# Altium schematic sheet P8_ref.SchDoc
size A3
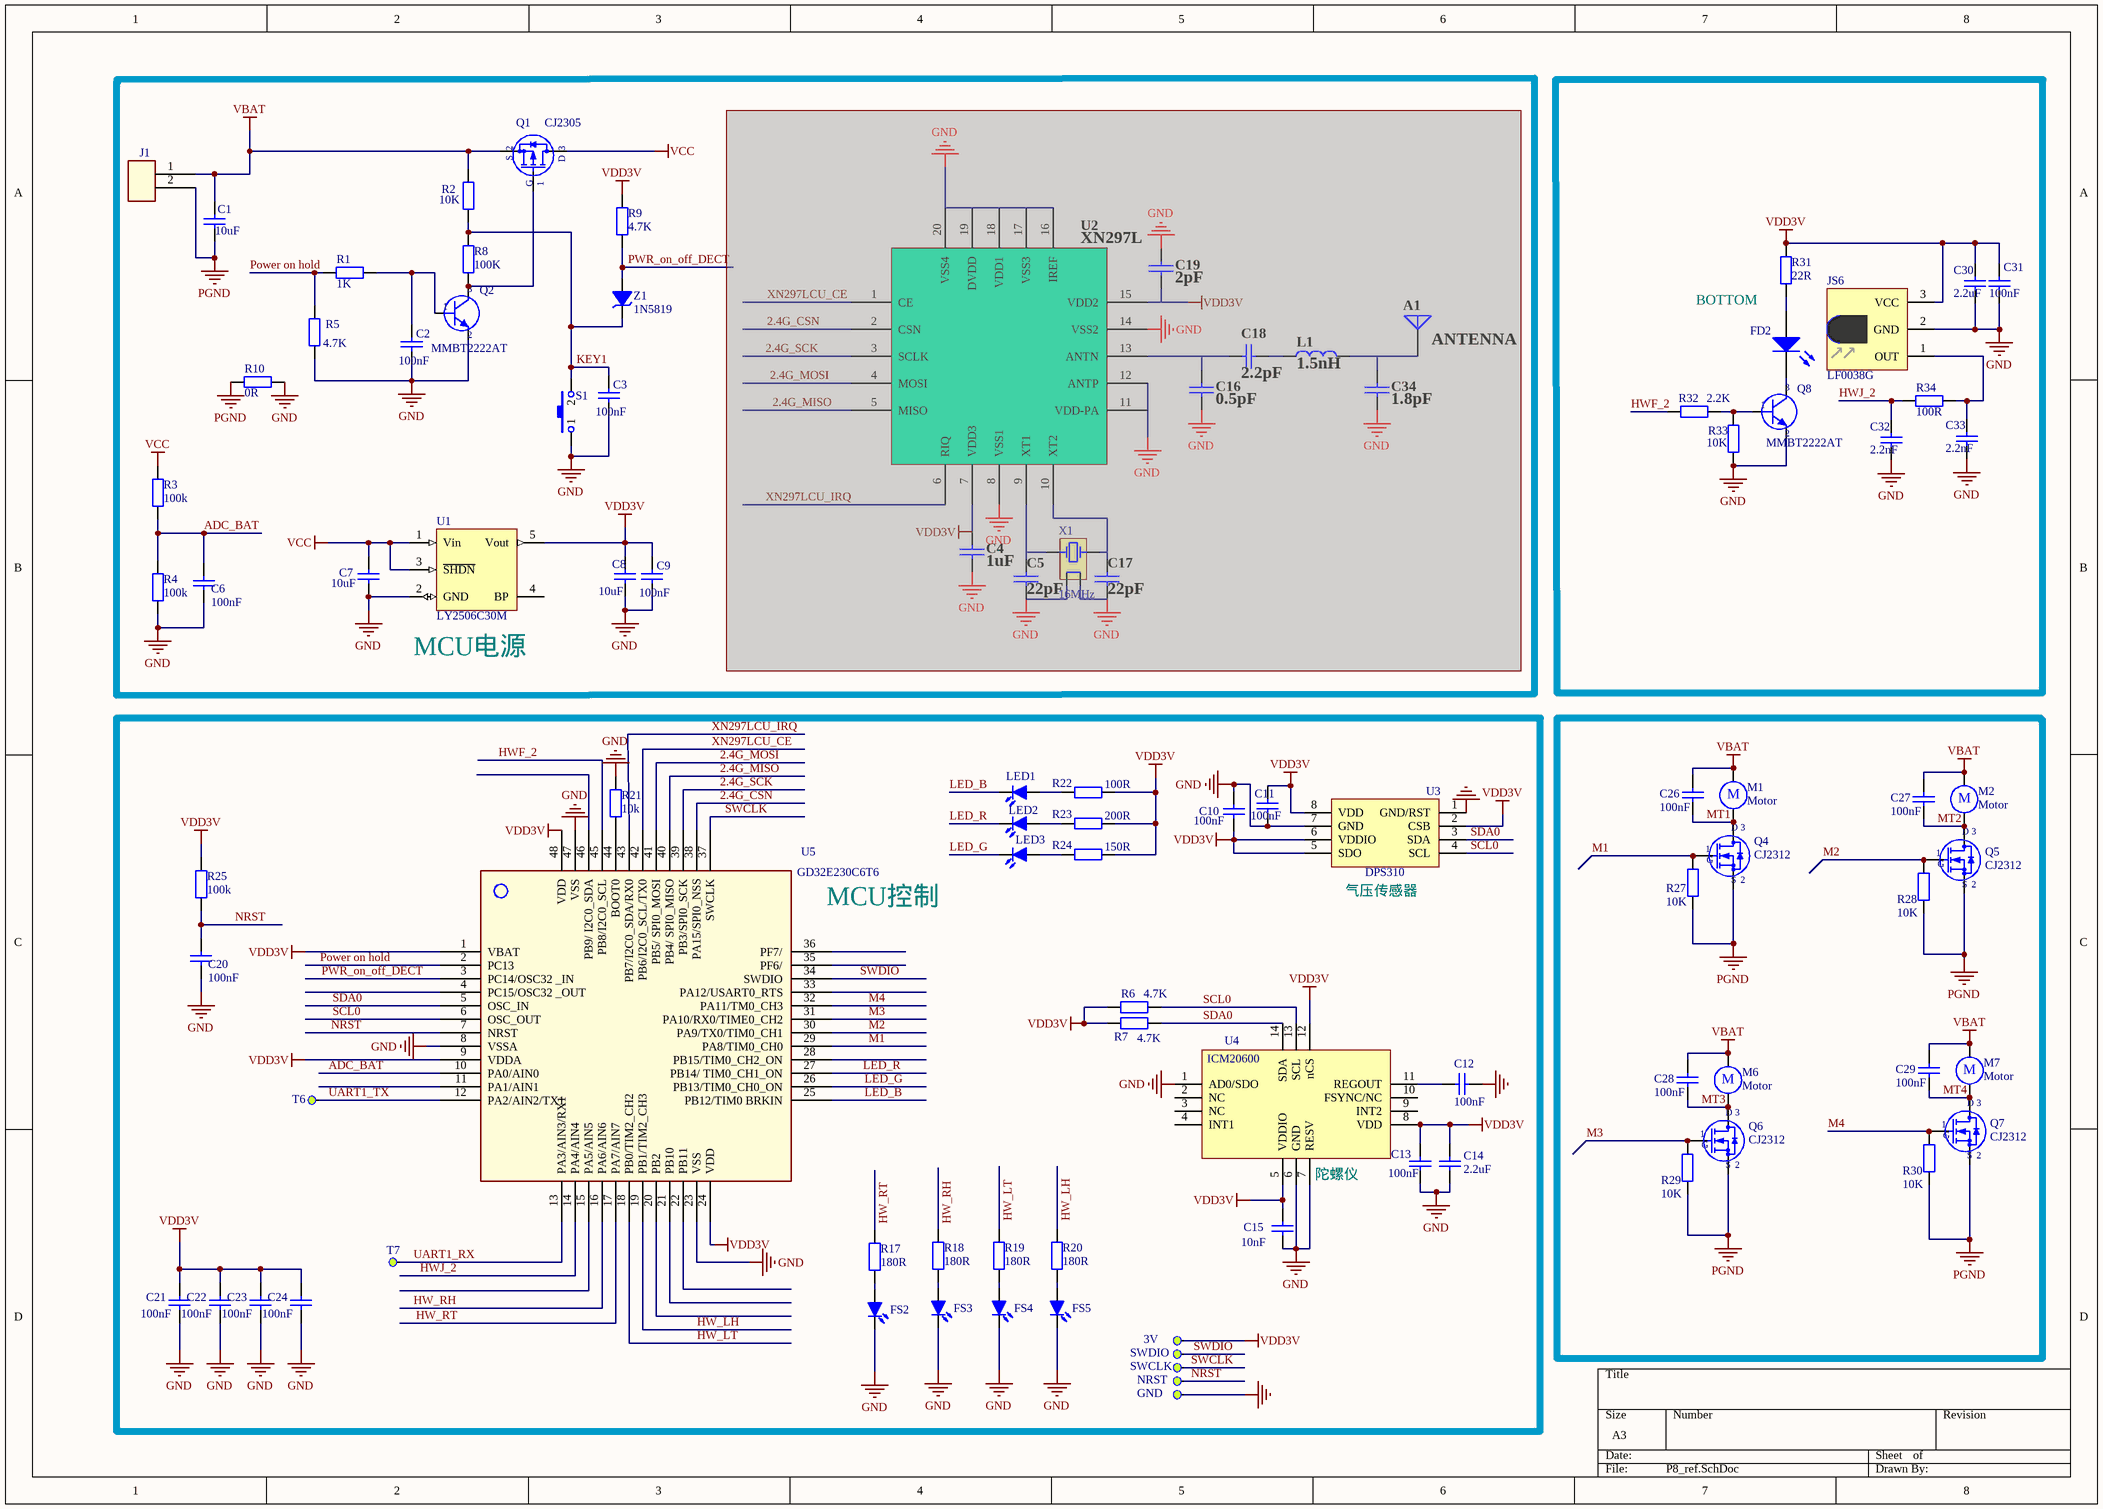
[diagram p0: P8_ref.SchDoc]

## Parts
3V  Test-Point  [Test-Point]  (value not drawn)  (no BOM)
A1  ANTENNA  [ANT 11*3]  (masked out: inside a compile mask, not in the netlist)
C1  10uF  [C-0603]
C2  100nF  [C-0402]
C3  100nF  [C-0402]
C4  1uF  [C-0402]  (masked out: inside a compile mask, not in the netlist)
C5  22pF  [C-0402]  (masked out: inside a compile mask, not in the netlist)
C6  100nF  [C-0402]
C7  10uF  [C-0603]
C8  10uF  [C-0603]
C9  100nF  [C-0402]
C10  100nF  [C-0402]
C11  100nF  [C-0402]
C12  100nF  [C-0402]
C13  100nF  [C-0402]
C14  2.2uF  [C-0402]
C15  10nF  [C-0402]
C16  0.5pF  [C-0402]  (masked out: inside a compile mask, not in the netlist)
C17  22pF  [C-0402]  (masked out: inside a compile mask, not in the netlist)
C18  2.2pF  [C-0402]  (masked out: inside a compile mask, not in the netlist)
C19  2pF  [C0603]  (masked out: inside a compile mask, not in the netlist)
C20  100nF  [C-0402]
C21  100nF  [C-0402]
C22  100nF  [C-0402]
C23  100nF  [C-0402]
C24  100nF  [C-0402]
C26  100nF  [C-0402]
C27  100nF  [C-0402]
C28  100nF  [C-0402]
C29  100nF  [C-0402]
C30  2.2uF  [C-0402]
C31  100nF  [C-0402]
C32  2.2nF  [C-0402]
C33  2.2nF  [C-0402]
C34  1.8pF  [C-0402]  (masked out: inside a compile mask, not in the netlist)
FD2  (no value)  [LED-3]
FS2  LED-RS  [PAD-2]  (value not drawn)
FS3  LED-RS  [PAD-2]  (value not drawn)
FS4  LED-RS  [PAD-2]  (value not drawn)
FS5  LED-RS  [PAD-2]  (value not drawn)
GND  Test-Point  [Test-Point]  (value not drawn)  (no BOM)
J1  (no value)  [Motor-6.0]
JS6  LF0038G  [LED-CA]
L1  1.5nH  [L-0402]  (masked out: inside a compile mask, not in the netlist)
LED1  LED-RS  [LED-0603]  (value not drawn)
LED2  LED-RS  [LED-0603]  (value not drawn)
LED3  LED-RS  [LED-0603]  (value not drawn)
M1  Motor  [Motor-3.0]  (no BOM)
M2  Motor  [Motor-3.0]  (no BOM)
M6  Motor  [Motor-3.0]  (no BOM)
M7  Motor  [Motor-3.0]  (no BOM)
NRST  Test-Point  [Test-Point]  (value not drawn)  (no BOM)
Q1  CJ2305  [SOT-23]
Q2  MMBT2222AT  [SOT-523]
Q4  CJ2312  [SOT-23C]
Q5  CJ2312  [SOT-23C]
Q6  CJ2312  [SOT-23C]
Q7  CJ2312  [SOT-23C]
Q8  MMBT2222AT  [SOT-523]
R1  1K  [R-0402]
R2  10K  [R-0402]
R3  100k  [R-0402]
R4  100k  [R-0402]
R5  4.7K  [R-0402]
R6  4.7K  [R-0402]
R7  4.7K  [R-0402]
R8  100K  [R-0402]
R9  4.7K  [R-0402]
R10  0R  [R-0603]
R17  180R  [R-0402]
R18  180R  [R-0402]
R19  180R  [R-0402]
R20  180R  [R-0402]
R21  10k  [R-0402]
R22  100R  [R-0402]
R23  200R  [R-0402]
R24  150R  [R-0402]
R25  100k  [R-0402]
R27  10K  [R-0402]
R28  10K  [R-0402]
R29  10K  [R-0402]
R30  10K  [R-0402]
R31  22R  [R-0402]
R32  2.2K  [R-0402]
R33  10K  [R-0402]
R34  100R  [R-0402]
S1  (no value)  [K3*2]
SWCLK  Test-Point  [Test-Point]  (value not drawn)  (no BOM)
SWDIO  Test-Point  [Test-Point]  (value not drawn)  (no BOM)
T6  Test-Point  [Test-Point]  (value not drawn)  (no BOM)
T7  Test-Point  [Test-Point]  (value not drawn)  (no BOM)
U1  LY2506C30M  [SOT23-5]
U2  XN297L  [QFN20/3x3/0.4/G]  (masked out: inside a compile mask, not in the netlist)
U3  DPS310  [LGA-8]
U4  ICM20600  [LLGA14]
U5  GD32E230C6T6  [LQFP-48]
X1  16MHz  [XTAL-3.2×2.5-SM]  (masked out: inside a compile mask, not in the netlist)
Z1  1N5819  [SOD-523]

## Blocks framed on the sheet
MCU电源: A1 C1-C9 C16-C19 C34 J1 L1 Q1 Q2 R1-R5 R8-R10 S1 U1 U2 X1 Z1
BOTTOM: C30-C33 FD2 JS6 Q8 R31-R34
MCU控制: 3V C10-C15 C20-C24 FS2-FS5 GND LED1-LED3 NRST R6 R7 R17-R25 SWCLK SWDIO T6 T7 U3-U5

## Nets
GND: C2.2 C3.2 C6.2 C7.2 C8.2 C9.2 C10.1 C11.2 C12.1 C13.1 C14.1 C15.1 C20.2 C21.2 C22.2 C23.2 C24.2 C30.2 C31.2 C32.2 C33.2 FS2.2(K) FS3.2(K) FS4.2(K) FS5.2(K) GND.0 JS6.2(GND) Q2.2(E) Q8.2(E) R4.1 R5.2 R10.1 R21.2 R33.1 S1.1 U1.2(GND) U3.1(GND/RST) U3.7(GND) U4.1(AD0/SDO) U4.6(GND) U4.7(RESV) U5.8(VSSA) U5.23(VSS) U5.47(VSS)
PGND: C1.2 J1.2 Q4.2(S) Q5.2(S) Q6.2(S) Q7.2(S) R10.2 R27.1 R28.1 R29.1 R30.1
VBAT: C1.1 C26.1 C27.1 C28.1 C29.1 J1.1 M1.1 M2.1 M6.1 M7.1 Q1.2(S) R2.2
VCC: C7.1 Q1.3(D) R3.2 U1.1(Vin) U1.3(~{SHDN})
VDD3V: 3V.0 C8.1 C9.1 C10.2 C11.1 C13.2 C14.2 C15.2 C21.1 C22.1 C23.1 C24.1 C30.1 C31.1 JS6.3(VCC) R6.2 R7.2 R9.1 R22.2 R23.2 R24.2 R25.1 R31.2 U1.5(Vout) U3.2(CSB) U3.5(SDO) U3.6(VDDIO) U3.8(VDD) U4.5(VDDIO) U4.8(VDD) U4.12(nCS) U5.1(VBAT) U5.9(VDDA) U5.24(VDD) U5.48(VDD)
2.4G_CSN: U5.38(PA15/SPI0_NSS)
2.4G_MISO: U5.40(PB4/_SPI0_MISO)
2.4G_MOSI: U5.41(PB5/_SPI0_MOSI)
2.4G_SCK: U5.39(PB3/SPI0_SCK)
ADC_BAT: C6.1 R3.1 R4.2 U5.10(PA0/AIN0)
HW_LH: R20.2 U5.19(PB1/TIM2_CH3)
HW_LT: R19.2 U5.18(PB0/TIM2_CH2)
HW_RH: R18.2 U5.16(PA6/AIN6)
HW_RT: R17.2 U5.17(PA7/AIN7)
HWF_2: R32.1 U5.45(PB8/I2C0_SCL)
HWJ_2: C32.1 R34.2 U5.14(PA4/AIN4)
KEY1: C3.1 R2.1 R8.1 S1.2 Z1.2(K)
LED_B: LED1.2(K) U5.25(PB12/TIM0_BRKIN)
LED_G: LED3.2(K) U5.26(PB13/TIM0_CH0_ON)
LED_R: LED2.2(K) U5.27(PB14/_TIM0_CH1_ON)
M1: Q4.1(G) R27.2 U5.29(PA8/TIM0_CH0)
M2: Q5.1(G) R28.2 U5.30(PA9/TX0/TIM0_CH1)
M3: Q6.1(G) R29.2 U5.31(PA10/RX0/TIME0_CH2)
M4: Q7.1(G) R30.2 U5.32(PA11/TM0_CH3)
MT1: C26.2 M1.2 Q4.3(D)
MT2: C27.2 M2.2 Q5.3(D)
MT3: C28.2 M6.2 Q6.3(D)
MT4: C29.2 M7.2 Q7.3(D)
NRST: C20.1 NRST.0 R25.2 U5.7(NRST)
Power on hold: R1.2 R5.1 U5.2(PC13)
PWR_on_off_DECT: R9.2 U5.3(PC14/OSC32__IN) Z1.1(A)
SCL0: R6.1 U3.4(SCL) U4.13(SCL) U5.6(OSC_OUT)
SDA0: R7.1 U3.3(SDA) U4.14(SDA) U5.5(OSC_IN)
SWCLK: SWCLK.0 U5.37(SWCLK)
SWDIO: SWDIO.0 U5.34(SWDIO)
UART1_RX: T7.0 U5.13(PA3/AIN3/RX1)
UART1_TX: T6.0 U5.12(PA2/AIN2/TX1)
XN297LCU_CE: U5.42(PB6/I2C0_SCL/TX0)
XN297LCU_IRQ: U5.43(PB7/I2C0_SDA/RX0)
NetC2_1: C2.1 Q2.1(B) R1.1
NetC12_2: C12.2 U4.11(REGOUT)
NetC33_1: C33.1 JS6.1(OUT) R34.1
NetFD2_1: FD2.1(A) R31.1
NetFD2_2: FD2.2(K) Q8.3(C)
NetFS2_1: FS2.1(A) R17.1
NetFS3_1: FS3.1(A) R18.1
NetFS4_1: FS4.1(A) R19.1
NetFS5_1: FS5.1(A) R20.1
NetLED1_1: LED1.1(A) R22.1
NetLED2_1: LED2.1(A) R23.1
NetLED3_1: LED3.1(A) R24.1
NetQ1_1: Q1.1(G) Q2.3(C) R8.2
NetQ8_1: Q8.1(B) R32.2 R33.2
NetR21_1: R21.1 U5.44(BOOT0)

Not connected (* = marked no-connect by the designer): U1 4(BP); U4 2(NC) 3(NC) 4(INT1) 9(INT2) 10(FSYNC/NC); U5 4(PC15/OSC32__OUT) 11(PA1/AIN1) 15(PA5/AIN5) 20(PB2) 21(PB10) 22(PB11) 28(PB15/TIM0_CH2_ON) 33(PA12/USART0_RTS) 35(PF6/) 36(PF7/) 46(PB9/_I2C0_SDA)

## Notes on the sheet
- (near U3) 气压传感器
- (near U4) 陀螺仪
- (in symbol Motor) M

## Library data of the parts
C1-C3 C6-C15 C20-C24 C26-C33 = CAP: Capacitor
  C2 C3 C9-C11: Published: 8-Jun-2000; LatestRevisionDate: 17-Jul-2002; LatestRevisionNote: Re-released for DXP Platform.; PackageReference: RAD-0.3; Publisher: Altium Limited; PackageDescription: Radial Cap, Thru-Hole; 2 Leads; 0.3 in Pin Spacing
  C6-C8 C12-C15 C20-C24 C26-C33: Published: 8-Jun-2000; LatestRevisionDate: 17-Jul-2002; LatestRevisionNote: Re-released for DXP Platform.; Publisher: Altium Limited; PackageDescription: Radial Cap, Thru-Hole; 2 Leads; 0.3 in Pin Spacing
C4 C5 C16-C19 C34 = CAP
FD2 = LED3: Typical BLUE SiC LED; Published: 8-Jun-2000; LatestRevisionDate: 17-Dec-2003; LatestRevisionNote: PCB Footprint replaced.; DatasheetVersion: 16-Apr-2002; PackageVersion: 16-Apr-2002; PackageReference: 3.5X2.8X1.9; Publisher: Altium Limited; PackageDescription: SM LED; 2 C-Bend Leads; Body 3.5 x 2.8 x 1.9 mm, inc leads (LxWxH typ)
FS2-FS5 LED1-LED3 = LED-SM
J1 = CON2
L1 = Indouctor
M1 M2 M6 M7 = Motor: Motor, General Kind; Published: 24-Mar-1999; LatestRevisionDate: 17-Jul-2002; LatestRevisionNote: Re-released for DXP Platform.; PackageReference: RB5-10.5; Publisher: Altium Limited; PackageDescription: Capacitor (Radial); 2 Leads
Q1 = MOSFET-P: P-Channel MOSFET; Published: 8-Jun-2000; LatestRevisionDate: 17-Jul-2002; LatestRevisionNote: Re-released for DXP Platform.; PackageVersion: 1995/1996; PackageReference: E3; Publisher: Altium Limited; PackageDescription: TO, Flat Index; 3 In-Line, Axial Leads; Body Dia. 4.6mm; Lead Dia. 0.5 mm (max)
Q2 Q8 = NPN[SOT-23]: EBC
Q4-Q7 = MOSFET-N: N-Channel MOSFET; Published: 8-Jun-2000; LatestRevisionDate: 17-Jul-2002; LatestRevisionNote: Re-released for DXP Platform.; PackageVersion: 1995/1996; PackageReference: E3; Publisher: Altium Limited; PackageDescription: TO, Flat Index; 3 In-Line, Axial Leads; Body Dia. 4.6mm; Lead Dia. 0.5 mm (max)
R1 R2 R8-R10 = Res2: Resistor; Published: 8-Jun-2000; LatestRevisionDate: 17-Jul-2002; LatestRevisionNote: Re-released for DXP Platform.; PackageReference: AXIAL-0.4; Publisher: Altium Limited; PackageDescription: Axial Device, Thru-Hole; 2 Leads; 0.4 in Pin Spacing
R3-R7 R17-R25 R27-R34 = Res: Resistor
  R5-R7: Value: 4.7K
  R17-R20: Value: 180R
  R22 R34: Value: 100R
  R23: Value: 200R
  R24: Value: 150R
  R31: Value: 22R
  R32: Value: 2.2K
  R33: Value: 10K
S1 = SW2: Switch; Published: 24-Mar-1999; LatestRevisionDate: 17-Jul-2002; LatestRevisionNote: Re-released for DXP Platform.; PackageReference: SPST-2; Publisher: Altium Limited; PackageDescription: Switch; 2 Leads
U1 = RT9167A-33PB
U2 = XN297
U3 = 2SMPB-02: Digital pressure sensor “ BMP280”or “2SMPB-02”
X1 = XTAL-4P
Z1 = D Schottky: Schottky Diode; Published: 8-Jun-2000; LatestRevisionDate: 17-Jul-2002; LatestRevisionNote: Re-released for DXP Platform.; PackageReference: DIODE-0.7; Publisher: Altium Limited; PackageDescription: Diode, Thru-Hole; 2 Leads; 0.7 in Pin Spacing